# Altium schematic sheet FMC_HPC_UFL_DEBUG_HPC_EF.SchDoc: HPC connector ROW E and ROW F, Testpoints for power supplies
size A4; Date: 13.12.2024; ApprovedBy: PFH; CompanyName: IAM Electronic GmbH; DrawnBy: PFH; Engineer: PFH; DocumentNumber: 7; Revision: A; SheetNumber: 7; SheetTotal: 9; Projekt: FMC HPC-U.FL Debug Board; Website: www.fmchub.com
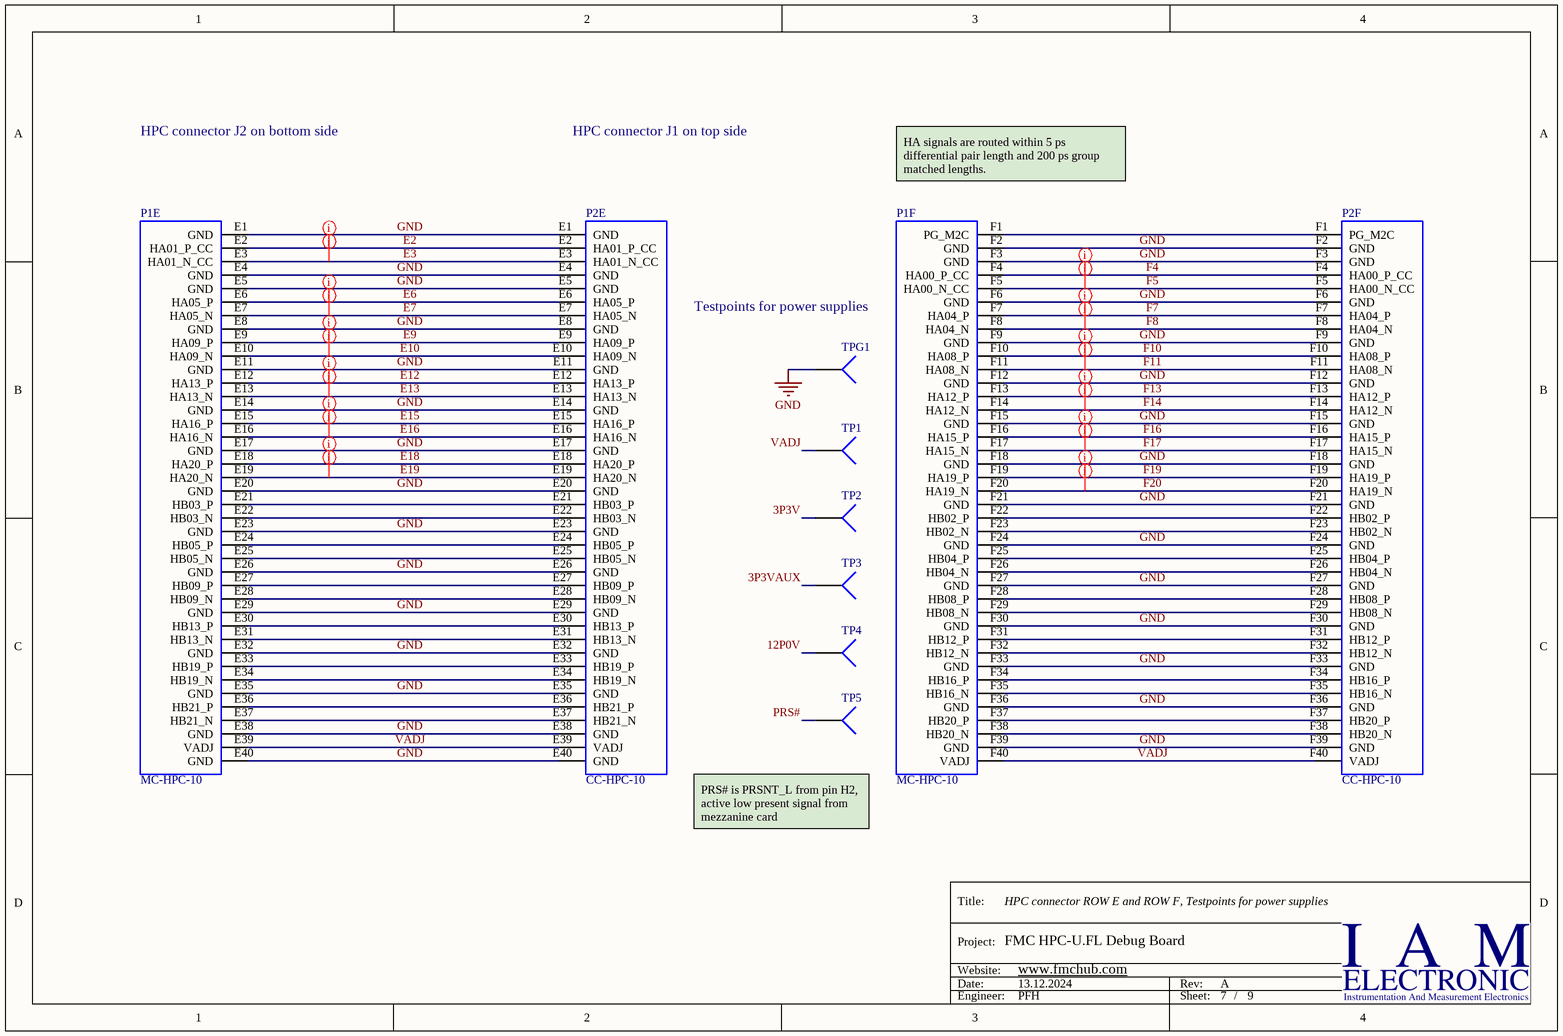
[diagram p0: FMC_HPC_UFL_DEBUG_HPC_EF.SchDoc]

## Parts
P1  MC-HPC-10  [ASP-134488-01]  (parts E,F of 10)
P2  CC-HPC-10  [ASP-134486-01]  (parts E,F of 10)
TP1  (no value)  [PIN1]  (no BOM)
TP2  (no value)  [PIN1]  (no BOM)
TP3  (no value)  [PIN1]  (no BOM)
TP4  (no value)  [PIN1]  (no BOM)
TP5  (no value)  [PIN1]  (no BOM)
TPG1  (no value)  [PIN1]  (no BOM)

## Nets
GND: P1.E1(GND) P1.E4(GND) P1.E5(GND) P1.E8(GND) P1.E11(GND) P1.E14(GND) P1.E17(GND) P1.E20(GND) P1.E23(GND) P1.E26(GND) P1.E29(GND) P1.E32(GND) P1.E35(GND) P1.E38(GND) P1.E40(GND) P1.F2(GND) P1.F3(GND) P1.F6(GND) P1.F9(GND) P1.F12(GND) P1.F15(GND) P1.F18(GND) P1.F21(GND) P1.F24(GND) P1.F27(GND) P1.F30(GND) P1.F33(GND) P1.F36(GND) P1.F39(GND) P2.E1(GND) P2.E4(GND) P2.E5(GND) P2.E8(GND) P2.E11(GND) P2.E14(GND) P2.E17(GND) P2.E20(GND) P2.E23(GND) P2.E26(GND) P2.E29(GND) P2.E32(GND) P2.E35(GND) P2.E38(GND) P2.E40(GND) P2.F2(GND) P2.F3(GND) P2.F6(GND) P2.F9(GND) P2.F12(GND) P2.F15(GND) P2.F18(GND) P2.F21(GND) P2.F24(GND) P2.F27(GND) P2.F30(GND) P2.F33(GND) P2.F36(GND) P2.F39(GND) TPG1.1
3P3V: TP2.1
3P3VAUX: TP3.1
12P0V: TP4.1
E2: P1.E2(HA01_P_CC) P2.E2(HA01_P_CC)
E3: P1.E3(HA01_N_CC) P2.E3(HA01_N_CC)
E6: P1.E6(HA05_P) P2.E6(HA05_P)
E7: P1.E7(HA05_N) P2.E7(HA05_N)
E9: P1.E9(HA09_P) P2.E9(HA09_P)
E10: P1.E10(HA09_N) P2.E10(HA09_N)
E12: P1.E12(HA13_P) P2.E12(HA13_P)
E13: P1.E13(HA13_N) P2.E13(HA13_N)
E15: P1.E15(HA16_P) P2.E15(HA16_P)
E16: P1.E16(HA16_N) P2.E16(HA16_N)
E18: P1.E18(HA20_P) P2.E18(HA20_P)
E19: P1.E19(HA20_N) P2.E19(HA20_N)
F4: P1.F4(HA00_P_CC) P2.F4(HA00_P_CC)
F5: P1.F5(HA00_N_CC) P2.F5(HA00_N_CC)
F7: P1.F7(HA04_P) P2.F7(HA04_P)
F8: P1.F8(HA04_N) P2.F8(HA04_N)
F10: P1.F10(HA08_P) P2.F10(HA08_P)
F11: P1.F11(HA08_N) P2.F11(HA08_N)
F13: P1.F13(HA12_P) P2.F13(HA12_P)
F14: P1.F14(HA12_N) P2.F14(HA12_N)
F16: P1.F16(HA15_P) P2.F16(HA15_P)
F17: P1.F17(HA15_N) P2.F17(HA15_N)
F19: P1.F19(HA19_P) P2.F19(HA19_P)
F20: P1.F20(HA19_N) P2.F20(HA19_N)
PRS#: TP5.1
VADJ: P1.E39(VADJ) P1.F40(VADJ) P2.E39(VADJ) P2.F40(VADJ) TP1.1
NetP1_E21: P1.E21(HB03_P) P2.E21(HB03_P)
NetP1_E22: P1.E22(HB03_N) P2.E22(HB03_N)
NetP1_E24: P1.E24(HB05_P) P2.E24(HB05_P)
NetP1_E25: P1.E25(HB05_N) P2.E25(HB05_N)
NetP1_E27: P1.E27(HB09_P) P2.E27(HB09_P)
NetP1_E28: P1.E28(HB09_N) P2.E28(HB09_N)
NetP1_E30: P1.E30(HB13_P) P2.E30(HB13_P)
NetP1_E31: P1.E31(HB13_N) P2.E31(HB13_N)
NetP1_E33: P1.E33(HB19_P) P2.E33(HB19_P)
NetP1_E34: P1.E34(HB19_N) P2.E34(HB19_N)
NetP1_E36: P1.E36(HB21_P) P2.E36(HB21_P)
NetP1_E37: P1.E37(HB21_N) P2.E37(HB21_N)
NetP1_F1: P1.F1(PG_M2C) P2.F1(PG_M2C)
NetP1_F22: P1.F22(HB02_P) P2.F22(HB02_P)
NetP1_F23: P1.F23(HB02_N) P2.F23(HB02_N)
NetP1_F25: P1.F25(HB04_P) P2.F25(HB04_P)
NetP1_F26: P1.F26(HB04_N) P2.F26(HB04_N)
NetP1_F28: P1.F28(HB08_P) P2.F28(HB08_P)
NetP1_F29: P1.F29(HB08_N) P2.F29(HB08_N)
NetP1_F31: P1.F31(HB12_P) P2.F31(HB12_P)
NetP1_F32: P1.F32(HB12_N) P2.F32(HB12_N)
NetP1_F34: P1.F34(HB16_P) P2.F34(HB16_P)
NetP1_F35: P1.F35(HB16_N) P2.F35(HB16_N)
NetP1_F37: P1.F37(HB20_P) P2.F37(HB20_P)
NetP1_F38: P1.F38(HB20_N) P2.F38(HB20_N)

## Layout directives
rule Width Constraint [Pref Impedance = 50,00ohms    Min Impedance = 50,00ohms    Max Impedance = 50,00ohms]; net class FMC_HA: E2, E3, E6, E7, E9, E10, E12, E13, E15, E16, E18, E19, F4, F5, F7, F8, F10, F11, F13, F14, F16, F17, F19, F20

## Notes on the sheet
- HPC connector J2 on bottom side
- HPC connector J1 on top side
- HA signals are routed within 5 ps differential pair length and 200 ps group matched lengths.
- Testpoints for power supplies
- PRS# is PRSNT_L from pin H2, active low present signal from mezzanine card
- Title:
- Project:
- Date:
- Website:
- Rev:
- Engineer:
- Sheet:
- /

## Library data of the parts
P1 = MC-HPC-10: MC-HPC-10, FMC High-pin count connector, lead free, 400 I/Os, male, 10 mm mated stack height; Manufacturer: Samtec; Manufacturer Ref: SEAM-40-03.5-S-10-2-A-K-TR-VITA57.0; Pitch: 1.27 mm; Mated Stack Height: 10 mm; Solder Type: Lead-Free; Number I/O: 400; PartName: ASP-134488-01; Part: ASP-134488-01; Vita PartNumber: MC-HPC-10; Pin Count: High; Gender: male; Supplier 1: Digi-Key; Supplier Part Number 1: SAM8730-ND
P2 = CC-HPC-10: CC-HPC-10, FMC High-pin count connector, lead free, 400 I/Os, female, 10 mm mated stack height; Manufacturer: Samtec; Manufacturer Ref: SEAF-40-06.5-10-A; Pitch: 1.27 mm; Mated Stack Height: 10 mm; Solder Type: Lead-Free; Number I/O: 400; PartName: ASP-134486-01; Part: ASP-134486-01; Vita PartNumber: CC-HPC-10; Pin Count: High; Gender: female; Supplier 1: Digi-Key; Supplier Part Number 1: SAM8728-ND
TP1-TP5 TPG1 = Socket: LatestRevisionDate: 17-Jul-2002; LatestRevisionNote: Re-released for DXP Platform.; Publisher: Altium Limited